# EAGLE design xen_daisy_motherboard (EAGLE 9.6.0)
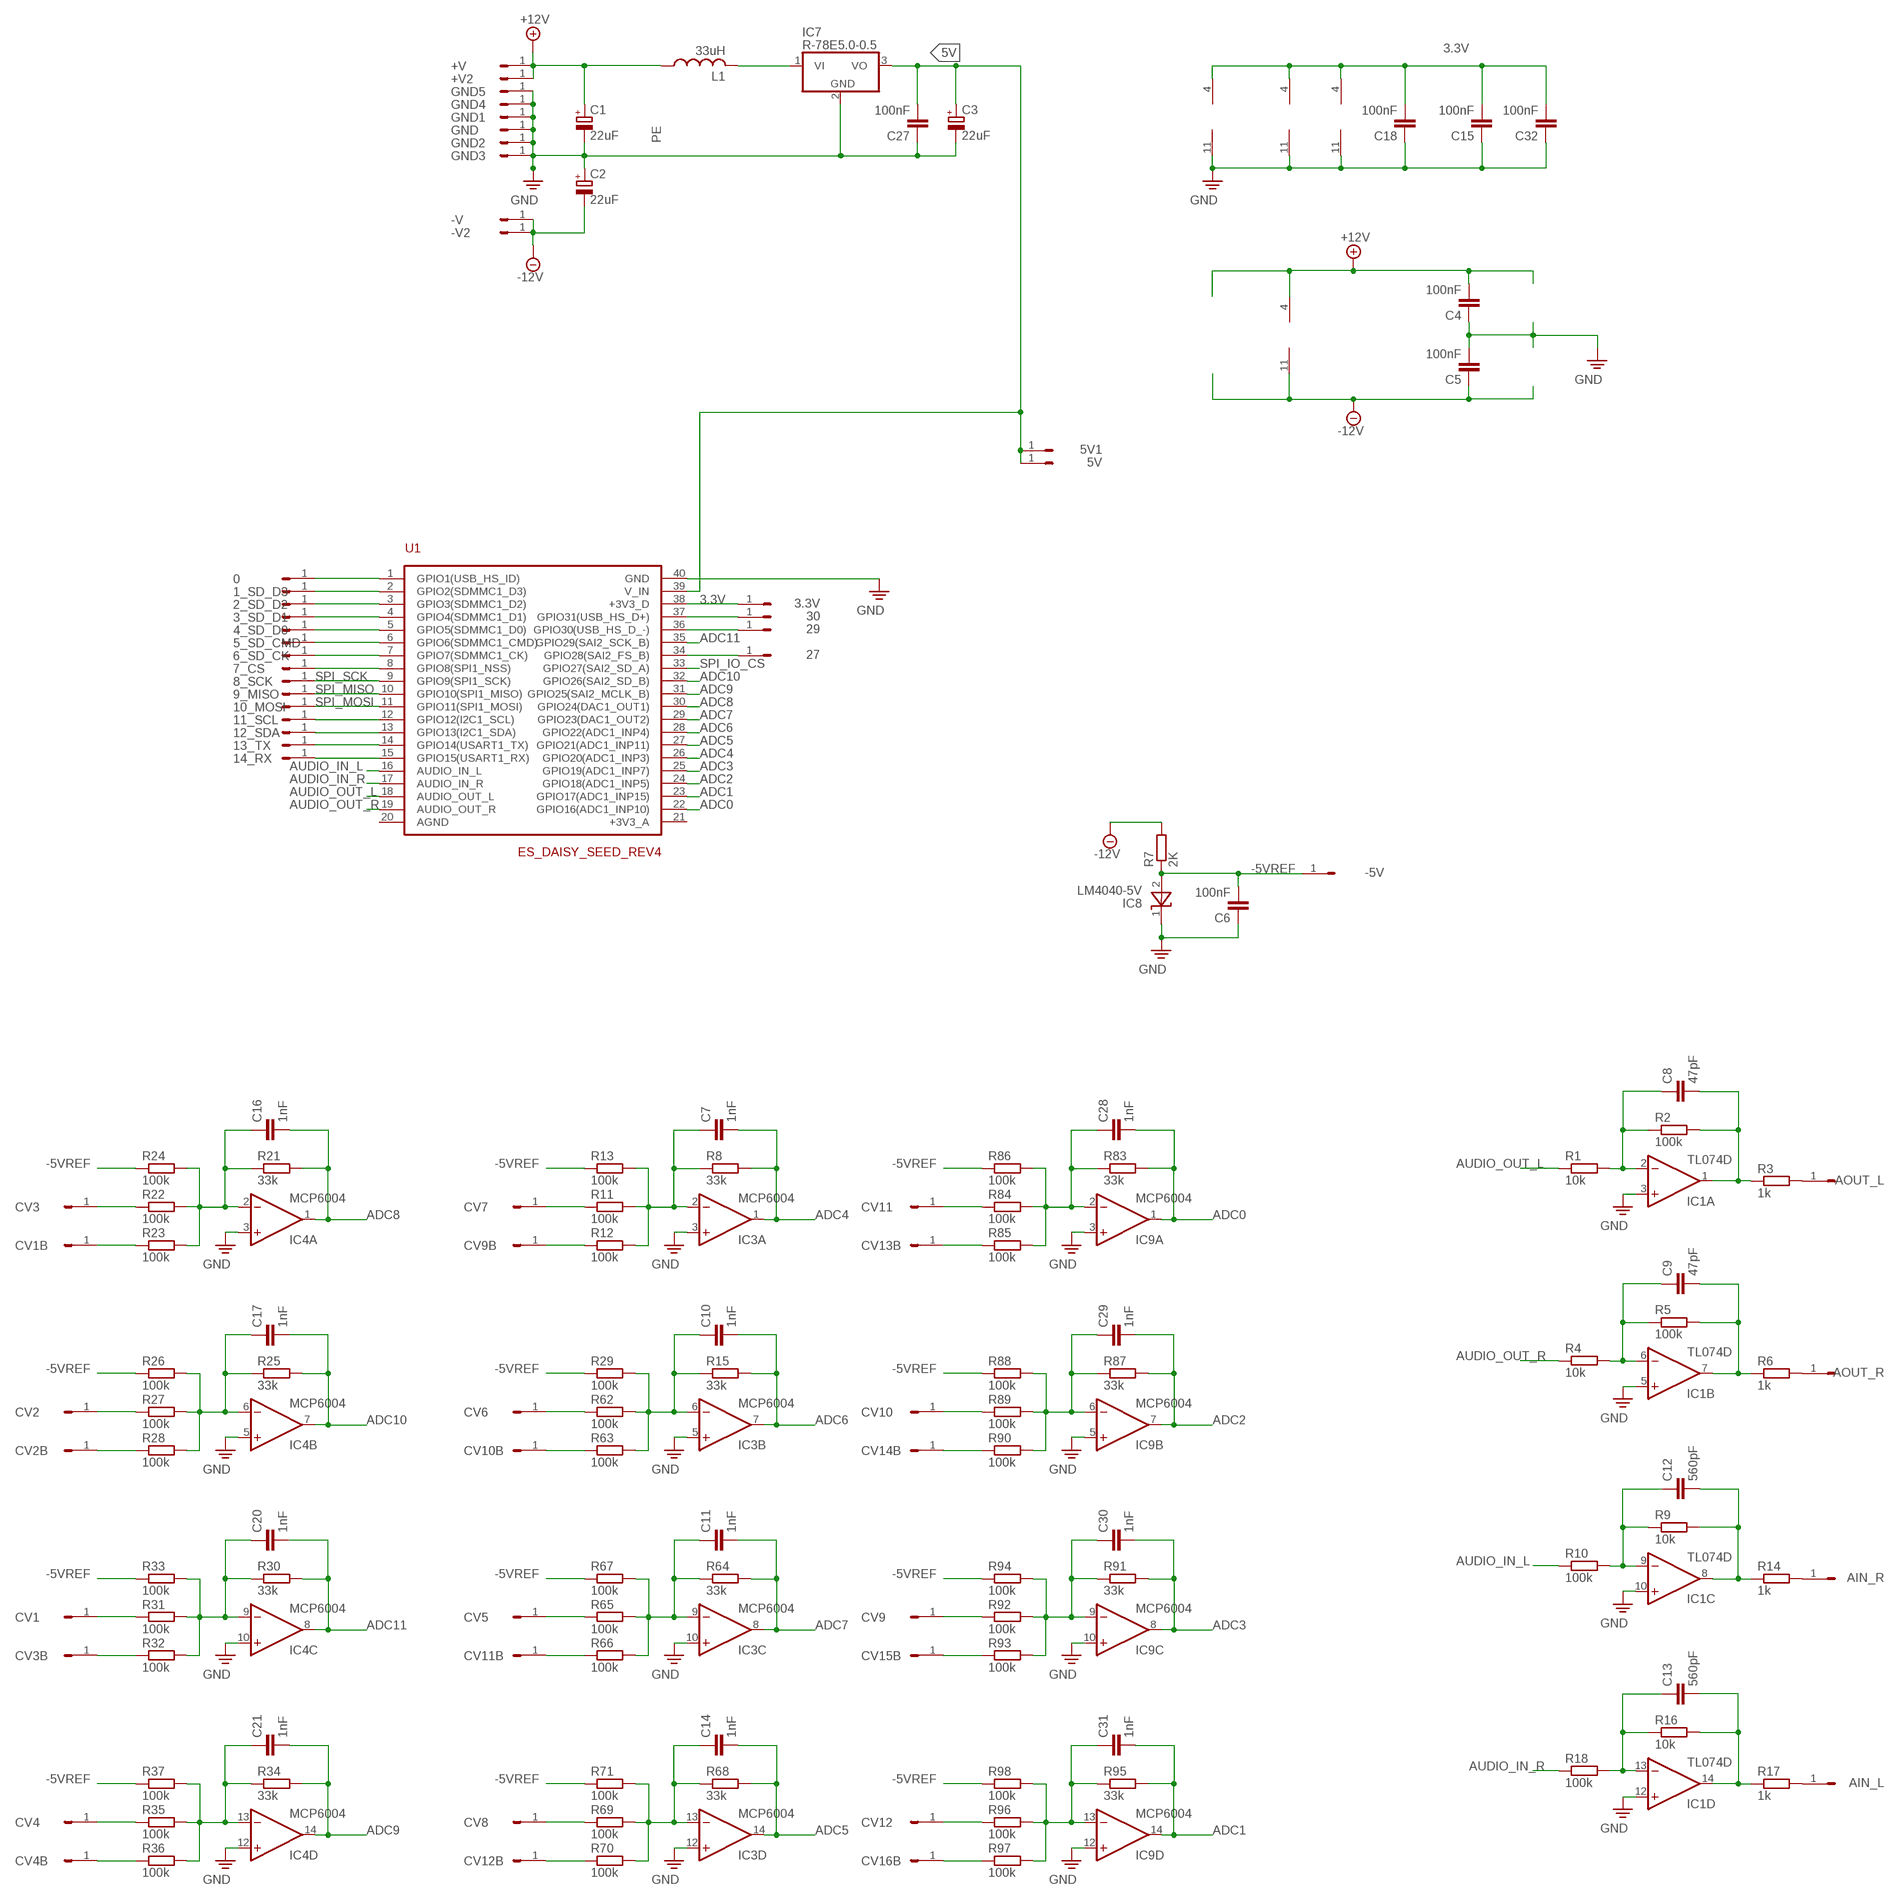
[diagram p0: schematic, sheet 1, part 1 of 2]
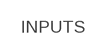
[diagram p1: schematic, sheet 1, part 2 of 2]

## Parts
0  HEADER/MALE/01  [HEADER/MALE/01]
1_SD_D3  HEADER/MALE/01  [HEADER/MALE/01]
2_SD_D2  HEADER/MALE/01  [HEADER/MALE/01]
3.3V  HEADER/MALE/01  [HEADER/MALE/01]
3_SD_D1  HEADER/MALE/01  [HEADER/MALE/01]
4_SD_D0  HEADER/MALE/01  [HEADER/MALE/01]
5_SD_CMD  HEADER/MALE/01  [HEADER/MALE/01]
5V  HEADER/MALE/01  [HEADER/MALE/01]
5V1  HEADER/MALE/01  [HEADER/MALE/01]
6_SD_CK  HEADER/MALE/01  [HEADER/MALE/01]
7_CS  HEADER/MALE/01  [HEADER/MALE/01]
8_SCK  HEADER/MALE/01  [HEADER/MALE/01]
9_MISO  HEADER/MALE/01  [HEADER/MALE/01]
10_MOSI  HEADER/MALE/01  [HEADER/MALE/01]
11_SCL  HEADER/MALE/01  [HEADER/MALE/01]
12_SDA  HEADER/MALE/01  [HEADER/MALE/01]
13_TX  HEADER/MALE/01  [HEADER/MALE/01]
14_RX  HEADER/MALE/01  [HEADER/MALE/01]
27  HEADER/MALE/01  [HEADER/MALE/01]
29  HEADER/MALE/01  [HEADER/MALE/01]
30  HEADER/MALE/01  [HEADER/MALE/01]
+V  HEADER/MALE/01  [HEADER/MALE/01]
+V2  HEADER/MALE/01  [HEADER/MALE/01]
-5V  HEADER/MALE/01  [HEADER/MALE/01]
-V  HEADER/MALE/01  [HEADER/MALE/01]
-V2  HEADER/MALE/01  [HEADER/MALE/01]
AIN_L  HEADER/MALE/01  [HEADER/MALE/01]
AIN_R  HEADER/MALE/01  [HEADER/MALE/01]
AOUT_L  HEADER/MALE/01  [HEADER/MALE/01]
AOUT_R  HEADER/MALE/01  [HEADER/MALE/01]
C1  22uF  CAPACITOR/POLARIZED  [PANASONIC_A]
C2  22uF  CAPACITOR/POLARIZED  [PANASONIC_A]
C3  22uF  CAPACITOR/POLARIZED  [PANASONIC_A]
C4  100nF  CAPACITORC0603  [C0603]
C5  100nF  CAPACITORC0603  [C0603]
C6  100nF  CAPACITORC0603  [C0603]
C7  1nF  CAPACITORC0603  [C0603]
C8  47pF  CAPACITORC0603  [C0603]
C9  47pF  CAPACITORC0603  [C0603]
C10  1nF  CAPACITORC0603  [C0603]
C11  1nF  CAPACITORC0603  [C0603]
C12  560pF  CAPACITORC0603  [C0603]
C13  560pF  CAPACITORC0603  [C0603]
C14  1nF  CAPACITORC0603  [C0603]
C15  100nF  CAPACITORC0603  [C0603]
C16  1nF  CAPACITORC0603  [C0603]
C17  1nF  CAPACITORC0603  [C0603]
C18  100nF  CAPACITORC0603  [C0603]
C20  1nF  CAPACITORC0603  [C0603]
C21  1nF  CAPACITORC0603  [C0603]
C27  100nF  CAPACITORC0603  [C0603]
C28  1nF  CAPACITORC0603  [C0603]
C29  1nF  CAPACITORC0603  [C0603]
C30  1nF  CAPACITORC0603  [C0603]
C31  1nF  CAPACITORC0603  [C0603]
C32  100nF  CAPACITORC0603  [C0603]
CV1  HEADER/MALE/01  [HEADER/MALE/01]
CV1B  HEADER/MALE/01  [HEADER/MALE/01]
CV2  HEADER/MALE/01  [HEADER/MALE/01]
CV2B  HEADER/MALE/01  [HEADER/MALE/01]
CV3  HEADER/MALE/01  [HEADER/MALE/01]
CV3B  HEADER/MALE/01  [HEADER/MALE/01]
CV4  HEADER/MALE/01  [HEADER/MALE/01]
CV4B  HEADER/MALE/01  [HEADER/MALE/01]
CV5  HEADER/MALE/01  [HEADER/MALE/01]
CV6  HEADER/MALE/01  [HEADER/MALE/01]
CV7  HEADER/MALE/01  [HEADER/MALE/01]
CV8  HEADER/MALE/01  [HEADER/MALE/01]
CV9  HEADER/MALE/01  [HEADER/MALE/01]
CV9B  HEADER/MALE/01  [HEADER/MALE/01]
CV10  HEADER/MALE/01  [HEADER/MALE/01]
CV10B  HEADER/MALE/01  [HEADER/MALE/01]
CV11  HEADER/MALE/01  [HEADER/MALE/01]
CV11B  HEADER/MALE/01  [HEADER/MALE/01]
CV12  HEADER/MALE/01  [HEADER/MALE/01]
CV12B  HEADER/MALE/01  [HEADER/MALE/01]
CV13B  HEADER/MALE/01  [HEADER/MALE/01]
CV14B  HEADER/MALE/01  [HEADER/MALE/01]
CV15B  HEADER/MALE/01  [HEADER/MALE/01]
CV16B  HEADER/MALE/01  [HEADER/MALE/01]
GND  HEADER/MALE/01  [HEADER/MALE/01]
GND1  HEADER/MALE/01  [HEADER/MALE/01]
GND2  HEADER/MALE/01  [HEADER/MALE/01]
GND3  HEADER/MALE/01  [HEADER/MALE/01]
GND4  HEADER/MALE/01  [HEADER/MALE/01]
GND5  HEADER/MALE/01  [HEADER/MALE/01]
IC1  TL074D  [SO14]
IC3  MCP6004  TL074D  [SO14]
IC4  MCP6004  TL074D  [SO14]
IC7  R-78E5.0-0.5  WE173950378  [WE78]
IC8  LM4040-5V  LM4040CYM3-2.5  [SOT-23]
IC9  MCP6004  TL074D  [SO14]
L1  33uH  INDUCTORL2012C  [L2012C]
R1  10k  RESISTOR  [R0603]
R2  100k  RESISTOR  [R0603]
R3  1k  RESISTOR  [R0603]
R4  10k  RESISTOR  [R0603]
R5  100k  RESISTOR  [R0603]
R6  1k  RESISTOR  [R0603]
R7  2K  RESISTOR  [R0603]
R8  33k  RESISTOR  [R0603]
R9  10k  RESISTOR  [R0603]
R10  100k  RESISTOR  [R0603]
R11  100k  RESISTOR  [R0603]
R12  100k  RESISTOR  [R0603]
R13  100k  RESISTOR  [R0603]
R14  1k  RESISTOR  [R0603]
R15  33k  RESISTOR  [R0603]
R16  10k  RESISTOR  [R0603]
R17  1k  RESISTOR  [R0603]
R18  100k  RESISTOR  [R0603]
R21  33k  RESISTOR  [R0603]
R22  100k  RESISTOR  [R0603]
R23  100k  RESISTOR  [R0603]
R24  100k  RESISTOR  [R0603]
R25  33k  RESISTOR  [R0603]
R26  100k  RESISTOR  [R0603]
R27  100k  RESISTOR  [R0603]
R28  100k  RESISTOR  [R0603]
R29  100k  RESISTOR  [R0603]
R30  33k  RESISTOR  [R0603]
R31  100k  RESISTOR  [R0603]
R32  100k  RESISTOR  [R0603]
R33  100k  RESISTOR  [R0603]
R34  33k  RESISTOR  [R0603]
R35  100k  RESISTOR  [R0603]
R36  100k  RESISTOR  [R0603]
R37  100k  RESISTOR  [R0603]
R62  100k  RESISTOR  [R0603]
R63  100k  RESISTOR  [R0603]
R64  33k  RESISTOR  [R0603]
R65  100k  RESISTOR  [R0603]
R66  100k  RESISTOR  [R0603]
R67  100k  RESISTOR  [R0603]
R68  33k  RESISTOR  [R0603]
R69  100k  RESISTOR  [R0603]
R70  100k  RESISTOR  [R0603]
R71  100k  RESISTOR  [R0603]
R83  33k  RESISTOR  [R0603]
R84  100k  RESISTOR  [R0603]
R85  100k  RESISTOR  [R0603]
R86  100k  RESISTOR  [R0603]
R87  33k  RESISTOR  [R0603]
R88  100k  RESISTOR  [R0603]
R89  100k  RESISTOR  [R0603]
R90  100k  RESISTOR  [R0603]
R91  33k  RESISTOR  [R0603]
R92  100k  RESISTOR  [R0603]
R93  100k  RESISTOR  [R0603]
R94  100k  RESISTOR  [R0603]
R95  33k  RESISTOR  [R0603]
R96  100k  RESISTOR  [R0603]
R97  100k  RESISTOR  [R0603]
R98  100k  RESISTOR  [R0603]
U1  ES_DAISY_SEED_REV4  [ES_DAISY_SEED]

## Nets
3.3V: 3.3V.1 C15.2 C18.2 C32.2 IC3.4(P:V+) IC4.4(P:V+) IC9.4(P:V+) U1.38(+3V3_D)
5V: 5V1.1 5V.1 C3.+ C27.2 IC7.3(VO) U1.39(V_IN)
+12V: +V2.1 +V.1 C1.+ C4.2 IC1.4(P:V+) L1.1
-5VREF: -5V.1 C6.2 IC8.2(A) R7.1 R13.1 R24.1 R26.1 R29.1 R33.1 R37.1 R67.1 R71.1 R86.1 R88.1 R94.1 R98.1
-12V: -V2.1 -V.1 C2.- C5.1 IC1.11(P:V-) R7.2
ADC0: C28.2 IC9.1(A:OUT) R83.2 U1.22(GPIO16(ADC1_INP10))
ADC1: C31.2 IC9.14(D:OUT) R95.2 U1.23(GPIO17(ADC1_INP15))
ADC2: C29.2 IC9.7(B:OUT) R87.2 U1.24(GPIO18(ADC1_INP5))
ADC3: C30.2 IC9.8(C:OUT) R91.2 U1.25(GPIO19(ADC1_INP7))
ADC4: C7.2 IC3.1(A:OUT) R8.2 U1.26(GPIO20(ADC1_INP3))
ADC5: C14.2 IC3.14(D:OUT) R68.2 U1.27(GPIO21(ADC1_INP11))
ADC6: C10.2 IC3.7(B:OUT) R15.2 U1.28(GPIO22(ADC1_INP4))
ADC7: C11.2 IC3.8(C:OUT) R64.2 U1.29(GPIO23(DAC1_OUT2))
ADC8: C16.2 IC4.1(A:OUT) R21.2 U1.30(GPIO24(DAC1_OUT1))
ADC9: C21.2 IC4.14(D:OUT) R34.2 U1.31(GPIO25(SAI2_MCLK_B))
ADC10: C17.2 IC4.7(B:OUT) R25.2 U1.32(GPIO26(SAI2_SD_B))
ADC11: C20.2 IC4.8(C:OUT) R30.2 U1.35(GPIO29(SAI2_SCK_B))
AUDIO_IN_L: R10.1 U1.16(AUDIO_IN_L)
AUDIO_IN_R: R18.1 U1.17(AUDIO_IN_R)
AUDIO_OUT_L: R1.1 U1.18(AUDIO_OUT_L)
AUDIO_OUT_R: R4.1 U1.19(AUDIO_OUT_R)
N$1: CV2.1 R27.1
N$2: C8.1 IC1.2(A:-IN) R1.2 R2.1
N$3: C8.2 IC1.1(A:OUT) R2.2 R3.1
N$4: C9.1 IC1.6(B:-IN) R4.2 R5.1
N$5: AOUT_L.1 R3.2
N$6: C9.2 IC1.7(B:OUT) R5.2 R6.1
N$7: AIN_R.1 R14.2
N$8: C7.1 IC3.2(A:-IN) R8.1 R11.2 R12.2 R13.2
N$9: AOUT_R.1 R6.2
N$12: C12.1 IC1.9(C:-IN) R9.1 R10.2
N$13: CV9B.1 R12.1
N$14: CV7.1 R11.1
N$15: C13.1 IC1.13(D:-IN) R16.1 R18.2
N$16: C10.1 IC3.6(B:-IN) R15.1 R29.2 R62.2 R63.2
N$17: C13.2 IC1.14(D:OUT) R16.2 R17.1
N$18: CV6.1 R62.1
N$19: CV10B.1 R63.1
N$20: C12.2 IC1.8(C:OUT) R9.2 R14.1
N$22: CV3.1 R22.1
N$24: C16.1 IC4.2(A:-IN) R21.1 R22.2 R23.2 R24.2
N$25: AIN_L.1 R17.2
N$26: CV2B.1 R28.1
N$27: CV1B.1 R23.1
N$29: C17.1 IC4.6(B:-IN) R25.1 R26.2 R27.2 R28.2
N$30: C21.1 IC4.13(D:-IN) R34.1 R35.2 R36.2 R37.2
N$31: CV4.1 R35.1
N$32: CV4B.1 R36.1
N$34: CV3B.1 R32.1
N$35: CV1.1 R31.1
N$36: C20.1 IC4.9(C:-IN) R30.1 R31.2 R32.2 R33.2
N$37: 27.1 U1.34(GPIO28(SAI2_FS_B))
N$38: 13_TX.1 U1.14(GPIO14(USART1_TX))
N$39: 14_RX.1 U1.15(GPIO15(USART1_RX))
N$40: 30.1 U1.37(GPIO31(USB_HS_D+))
N$41: 6_SD_CK.1 U1.7(GPIO7(SDMMC1_CK))
N$45: 12_SDA.1 U1.13(GPIO13(I2C1_SDA))
N$46: 11_SCL.1 U1.12(GPIO12(I2C1_SCL))
N$51: IC7.1(VI) L1.2
N$57: C14.1 IC3.13(D:-IN) R68.1 R69.2 R70.2 R71.2
N$60: CV8.1 R69.1
N$68: CV12B.1 R70.1
N$69: CV11B.1 R66.1
N$70: CV5.1 R65.1
N$71: C11.1 IC3.9(C:-IN) R64.1 R65.2 R66.2 R67.2
N$74: 29.1 U1.36(GPIO30(USB_HS_D_-))
N$75: C28.1 IC9.2(A:-IN) R83.1 R84.2 R85.2 R86.2
N$76: CV13B.1 R85.1
N$77: CV11.1 R84.1
N$78: C29.1 IC9.6(B:-IN) R87.1 R88.2 R89.2 R90.2
N$79: CV10.1 R89.1
N$80: CV14B.1 R90.1
N$81: C31.1 IC9.13(D:-IN) R95.1 R96.2 R97.2 R98.2
N$82: CV12.1 R96.1
N$83: CV16B.1 R97.1
N$84: CV15B.1 R93.1
N$102: CV9.1 R92.1
N$103: C30.1 IC9.9(C:-IN) R91.1 R92.2 R93.2 R94.2
N$108: 7_CS.1 U1.8(GPIO8(SPI1_NSS))
N$109: 5_SD_CMD.1 U1.6(GPIO6(SDMMC1_CMD))
N$110: 4_SD_D0.1 U1.5(GPIO5(SDMMC1_D0))
N$111: 3_SD_D1.1 U1.4(GPIO4(SDMMC1_D1))
N$112: 2_SD_D2.1 U1.3(GPIO3(SDMMC1_D2))
N$113: 1_SD_D3.1 U1.2(GPIO2(SDMMC1_D3))
N$114: 0.1 U1.1(GPIO1(USB_HS_ID))
PE: C1.- C2.+ C3.- C4.1 C5.2 C6.1 C15.1 C18.1 C27.1 C32.1 GND1.1 GND2.1 GND3.1 GND4.1 GND5.1 GND.1 IC1.3(A:+IN) IC1.5(B:+IN) IC1.10(C:+IN) IC1.12(D:+IN) IC3.3(A:+IN) IC3.5(B:+IN) IC3.10(C:+IN) IC3.11(P:V-) IC3.12(D:+IN) IC4.3(A:+IN) IC4.5(B:+IN) IC4.10(C:+IN) IC4.11(P:V-) IC4.12(D:+IN) IC7.2(GND) IC8.1(C) IC9.3(A:+IN) IC9.5(B:+IN) IC9.10(C:+IN) IC9.11(P:V-) IC9.12(D:+IN) U1.40(GND) ; supply symbol labelled GND
SPI_IO_CS: U1.33(GPIO27(SAI2_SD_A))
SPI_MISO: 9_MISO.1 U1.10(GPIO10(SPI1_MISO))
SPI_MOSI: 10_MOSI.1 U1.11(GPIO11(SPI1_MOSI))
SPI_SCK: 8_SCK.1 U1.9(GPIO9(SPI1_SCK))
Unconnected: U1.20(AGND) U1.21(+3V3_A)

## Notes on the sheet
- INPUTS

## Library data of the parts
0 1_SD_D3 2_SD_D2 3.3V 3_SD_D1 4_SD_D0 5_SD_CMD 5V 5V1 6_SD_CK 7_CS 8_SCK 9_MISO 10_MOSI 11_SCL 12_SDA 13_TX 14_RX 27 29 30 +V +V2 -5V -V -V2 AIN_L AIN_R AOUT_L AOUT_R CV1 CV1B CV2 CV2B CV3 CV3B CV4 CV4B CV5-CV9 CV9B CV10 CV10B CV11 CV11B CV12 CV12B CV13B CV14B CV15B CV16B GND GND1-GND5 = connectors:HEADER/MALE/01; SPICEPREFIX: X
C1-C3 = capacitors:CAPACITOR/POLARIZED: POLARIZED CAPACITOR, European symbol; SPICEPREFIX: C
C4-C18 C20 C21 C27-C32 = capacitors:CAPACITOR: CAPACITOR, European symbol
IC1 IC3 IC4 IC9 = ic_analogue:TL074: OP AMP
IC7 = ic_voltage_reg:WE173950378
IC8 = ic_voltage_reg:LM4040
L1 = resistors:INDUCTOR
R1-R18 R21-R37 R62-R71 R83-R98 = resistors:RESISTOR: RESISTOR, European symbol
U1 = microcontroller:ES_DAISY_SEED_REV4; IPN: Daisy Seed

## Board
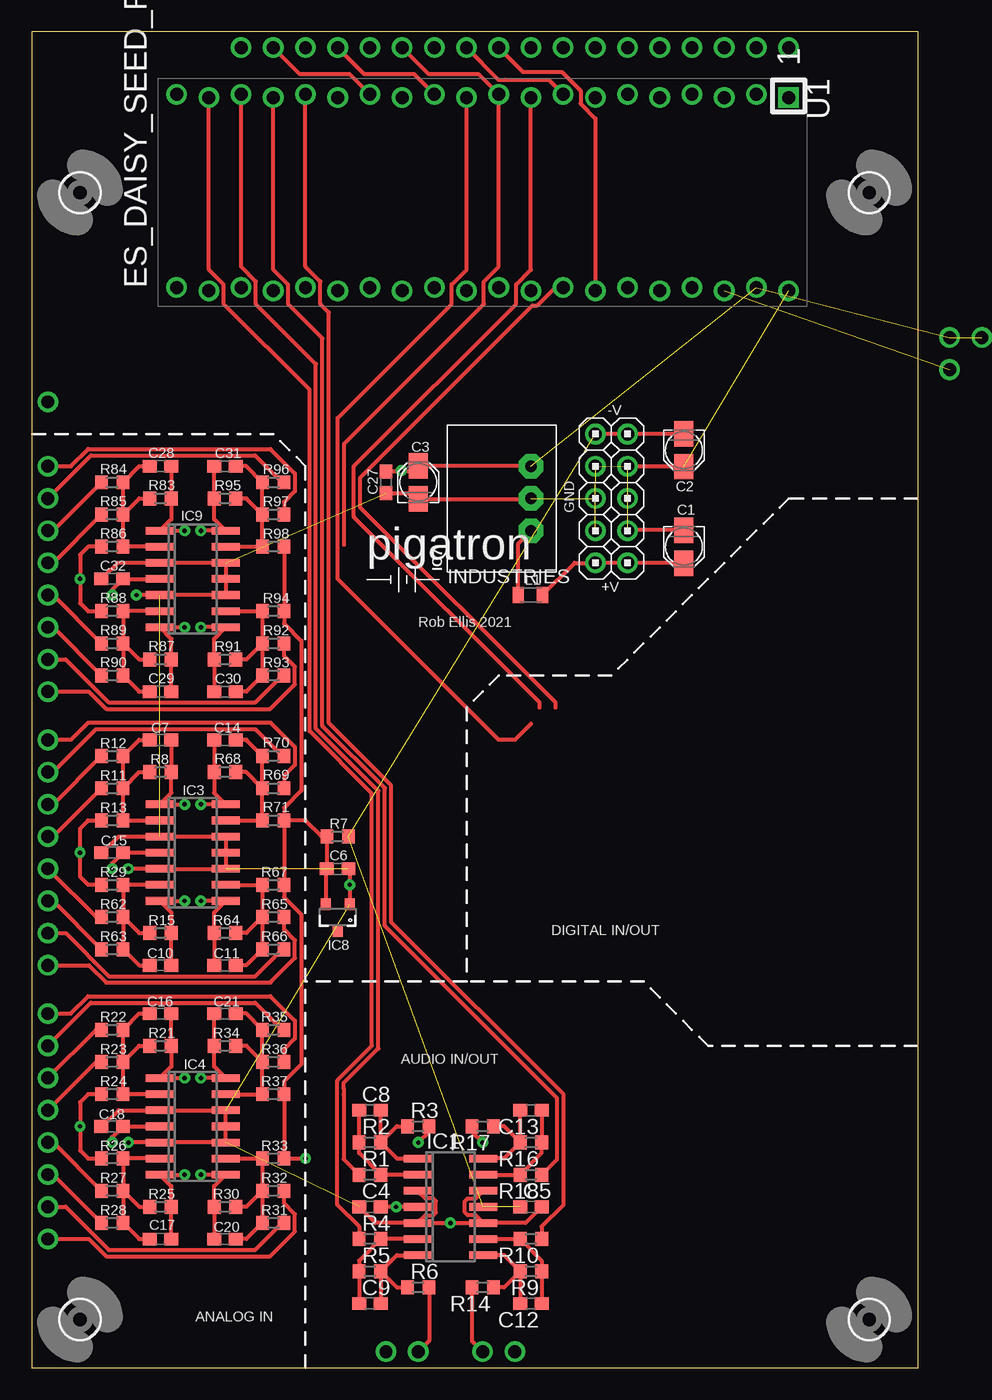
[diagram p2: board, top side]
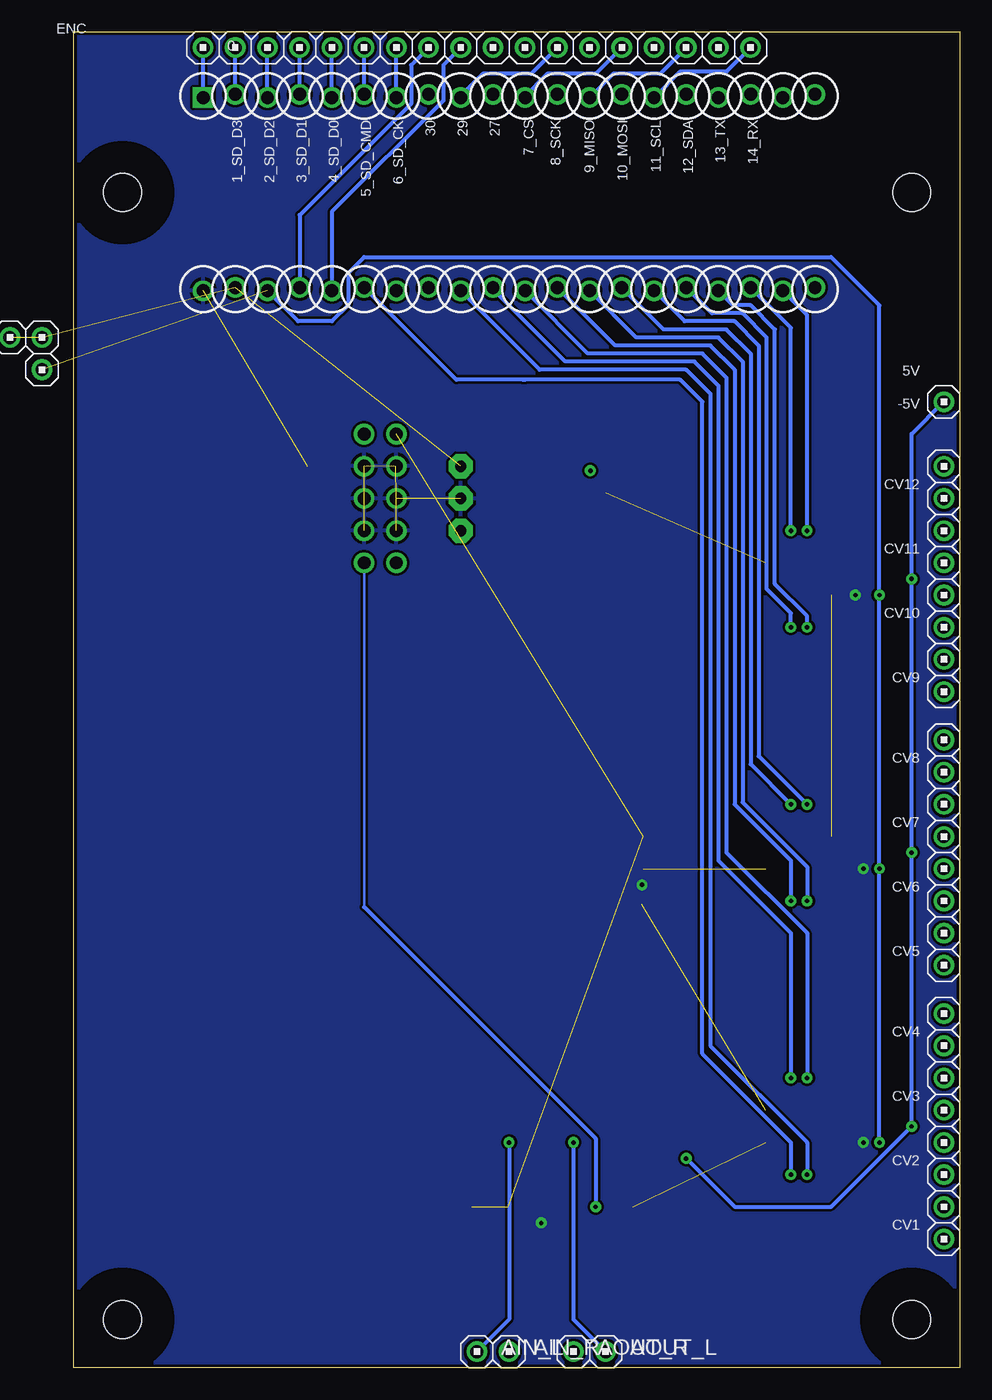
[diagram p3: board, bottom side, seen from below]

Size 69.9 x 105.4 mm. Coordinates in mm from the lower left corner, seen from the top.
Outline: 0,0 69.9,0 69.9,105.4 0,105.4 0,0
Copper layers (1*16): Top 0.0356mm / dielectric 1.5011mm / Bottom 0.0356mm
Design rules "pigatron *": minimum track width 8mil, minimum drill 13mil, track to track 8mil, track to pad 8mil, pad to pad 8mil, via to via 8mil, smd to smd 6mil, copper to edge 10mil, drill to drill 10mil, minimum pad ring 12mil, minimum via ring 10mil, stop-mask expansion 4mil, vias tented up to drill 0mil, thermal gap 10mil

### Footprints (pad centres in the part's own frame; a part is rotated, then mirrored left to right if it is on the bottom)
HEADER/MALE/01 = drill 1.016: 1 0,0
PANASONIC_A = smd 2 x 1.5: + 1.3,0; - -1.3,0
C0603 = smd 1.1 x 1: 1 -0.85,0; 2 0.85,0
SO14 = smd 0.6 x 2.2: 1 -3.81,-2.6; 2 -2.54,-2.6; 3 -1.27,-2.6; 4 0,-2.6; 5 1.27,-2.6; 6 2.54,-2.6; 7 3.81,-2.6; 8 3.81,2.6; 9 2.54,2.6; 10 1.27,2.6; 11 0,2.6; 12 -1.27,2.6; 13 -2.54,2.6; 14 -3.81,2.6
WE78 = drill 0.9 pad 1.93 octagon: 1 -2.54,0; 2 0,0; 3 2.54,0
SOT-23 = smd 0.8 x 0.9: 1 -0.95,-1; 2 0.95,-1; 3 0,1.1
L2012C = smd 0.9 x 1.25: 1 -0.9,0; 2 1,0
R0603 = smd 1 x 1.1: 1 -0.85,0; 2 0.85,0
ES_DAISY_SEED = drill 1.016 square: 1 -7.493,24.13 | drill 1.016: 2 -7.747,21.59; 3 -7.493,19.05; 4 -7.747,16.51; 5 -7.493,13.97; 6 -7.747,11.43; 7 -7.493,8.89; 8 -7.747,6.35; 9 -7.493,3.81; 10 -7.747,1.27; 11 -7.493,-1.27; 12 -7.747,-3.81; 13 -7.493,-6.35; 14 -7.747,-8.89; 15 -7.493,-11.43; 16 -7.747,-13.97; 17 -7.493,-16.51; 18 -7.747,-19.05; 19 -7.493,-21.59; 20 -7.747,-24.13; 21 7.493,-24.13; 22 7.747,-21.59; 23 7.493,-19.05; 24 7.747,-16.51; 25 7.493,-13.97; 26 7.747,-11.43; 27 7.493,-8.89; 28 7.747,-6.35; 29 7.493,-3.81; 30 7.747,-1.27; 31 7.493,1.27; 32 7.747,3.81; 33 7.493,6.35; 34 7.747,8.89; 35 7.493,11.43; 36 7.747,13.97; 37 7.493,16.51; 38 7.747,19.05; 39 7.493,21.59; 40 7.747,24.13
STANDOFF/3.0 = hole 3: 0,0

### Placement (x,y rotation side)
0  59.69,104.14 0 bottom
1_SD_D3  57.15,104.14 270 bottom
2_SD_D2  54.61,104.14 270 bottom
3.3V  72.39,78.74 270 bottom
3_SD_D1  52.07,104.14 270 bottom
4_SD_D0  49.53,104.14 270 bottom
5_SD_CMD  46.99,104.14 270 bottom
5V  74.93,81.28 0 bottom  (outside the outline)
5V1  72.39,81.28 180 bottom
6_SD_CK  44.45,104.14 270 bottom
7_CS  34.29,104.14 270 bottom
8_SCK  31.75,104.14 270 bottom
9_MISO  29.21,104.14 270 bottom
10_MOSI  26.67,104.14 270 bottom
11_SCL  24.13,104.14 270 bottom
12_SDA  21.59,104.14 270 bottom
13_TX  19.05,104.14 270 bottom
14_RX  16.51,104.14 270 bottom
27  36.83,104.14 270 bottom
29  39.37,104.14 270 bottom
30  41.91,104.14 270 bottom
+V  46.99,63.5 0 top
+V2  44.45,63.5 180 top
-5V  1.27,76.2 180 bottom
-V  46.99,73.66 0 top
-V2  44.45,73.66 180 top
AIN_L  38.1,1.27 0 bottom
AIN_R  35.56,1.27 0 bottom
AOUT_L  27.94,1.27 0 bottom
AOUT_R  30.48,1.27 0 bottom
C1  51.44,64.77 270 top
C2  51.44,72.39 270 top
C3  30.48,69.85 90 top
C4  26.67,12.7 0 top
C5  39.37,12.7 0 top
C6  24.13,39.37 180 top
C7  10.16,49.53 0 top
C8  26.67,20.32 0 top
C9  26.67,5.08 0 top
C10  10.16,31.75 0 top
C11  15.24,31.75 180 top
C12  39.37,5.08 180 top
C13  39.37,20.32 180 top
C14  15.24,49.53 180 top
C15  6.35,40.64 0 top
C16  10.16,27.94 0 top
C17  10.16,10.16 0 top
C18  6.35,19.05 0 top
C20  15.24,10.16 180 top
C21  15.24,27.94 180 top
C27  27.94,69.85 90 top
C28  10.16,71.12 0 top
C29  10.16,53.34 0 top
C30  15.24,53.34 180 top
C31  15.24,71.12 180 top
C32  6.35,62.23 0 top
CV1  1.27,12.7 0 bottom
CV1B  1.27,20.32 0 bottom
CV2  1.27,17.78 0 bottom
CV2B  1.27,15.24 0 bottom
CV3  1.27,22.86 0 bottom
CV3B  1.27,10.16 0 bottom
CV4  1.27,25.4 0 bottom
CV4B  1.27,27.94 0 bottom
CV5  1.27,31.75 180 bottom
CV6  1.27,39.37 180 bottom
CV7  1.27,41.91 180 bottom
CV8  1.27,49.53 180 bottom
CV9  1.27,53.34 180 bottom
CV9B  1.27,44.45 180 bottom
CV10  1.27,60.96 180 bottom
CV10B  1.27,36.83 180 bottom
CV11  1.27,66.04 180 bottom
CV11B  1.27,34.29 180 bottom
CV12  1.27,68.58 180 bottom
CV12B  1.27,46.99 180 bottom
CV13B  1.27,63.5 180 bottom
CV14B  1.27,58.42 180 bottom
CV15B  1.27,55.88 180 bottom
CV16B  1.27,71.12 180 bottom
GND  46.99,68.58 0 top
GND1  46.99,71.12 0 top
GND2  44.45,66.04 180 top
GND3  46.99,66.04 180 top
GND4  44.45,68.58 0 top
GND5  44.45,71.12 0 top
IC1  33.02,12.7 270 top
IC3  12.7,40.64 270 top
IC4  12.7,19.05 270 top
IC7  39.37,68.58 90 top
IC8  24.13,35.56 180 top
IC9  12.7,62.23 270 top
L1  39.37,60.96 180 top
R1  26.67,15.24 0 top
R2  26.67,17.78 0 top
R3  30.48,19.05 0 top
R4  26.67,10.16 0 top
R5  26.67,7.62 0 top
R6  30.48,6.35 0 top
R7  24.13,41.91 0 top
R8  10.16,46.99 0 top
R9  39.37,7.62 180 top
R10  39.37,10.16 180 top
R11  6.35,45.72 0 top
R12  6.35,48.26 0 top
R13  6.35,43.18 0 top
R14  35.56,6.35 180 top
R15  10.16,34.29 0 top
R16  39.37,17.78 180 top
R17  35.56,19.05 180 top
R18  39.37,15.24 180 top
R21  10.16,25.4 0 top
R22  6.35,26.67 0 top
R23  6.35,24.13 0 top
R24  6.35,21.59 0 top
R25  10.16,12.7 0 top
R26  6.35,16.51 0 top
R27  6.35,13.97 0 top
R28  6.35,11.43 0 top
R29  6.35,38.1 0 top
R30  15.24,12.7 180 top
R31  19.05,11.43 180 top
R32  19.05,13.97 180 top
R33  19.05,16.51 180 top
R34  15.24,25.4 180 top
R35  19.05,26.67 180 top
R36  19.05,24.13 180 top
R37  19.05,21.59 180 top
R62  6.35,35.56 0 top
R63  6.35,33.02 0 top
R64  15.24,34.29 180 top
R65  19.05,35.56 180 top
R66  19.05,33.02 180 top
R67  19.05,38.1 180 top
R68  15.24,46.99 180 top
R69  19.05,45.72 180 top
R70  19.05,48.26 180 top
R71  19.05,43.18 180 top
R83  10.16,68.58 0 top
R84  6.35,69.85 0 top
R85  6.35,67.31 0 top
R86  6.35,64.77 0 top
R87  10.16,55.88 0 top
R88  6.35,59.69 0 top
R89  6.35,57.15 0 top
R90  6.35,54.61 0 top
R91  15.24,55.88 180 top
R92  19.05,57.15 180 top
R93  19.05,54.61 180 top
R94  19.05,59.69 180 top
R95  15.24,68.58 180 top
R96  19.05,69.85 180 top
R97  19.05,67.31 180 top
R98  19.05,64.77 180 top
U1  35.56,92.71 270 top
U$1  [PIGATRON-LOGO]  35.31,63.75 0 top
U$2  [STANDOFF/3.0]  66.04,3.81 180 top
U$3  [STANDOFF/3.0]  3.81,3.81 180 top
U$4  [STANDOFF/3.0]  66.04,92.71 180 top
U$5  [STANDOFF/3.0]  3.81,92.71 180 top

### Tracks (layer width: path | path; a pad name or v marks a point on that pad's centre or on a via)
3.3V  (via drill 0.35)  (1 unrouted)
  Top 0.305: IC4.4 C18.2 6.35,18.2 v6.35,17.78 | IC3.4 C15.2 6.35,39.79 v6.35,39.37 | IC9.4 C32.2 6.35,61.38 v6.35,60.96
  Bottom 0.305: v6.35,17.78 v6.35,39.37 v6.35,60.96 6.35,83.82 10.16,87.63 46.99,87.63 48.26,86.36 48.26,83.82 49.53,82.55 52.2,82.55 U1.38
5V  (via drill 0.35)  (3 unrouted)
  Top 0.305: IC7.3 30.51,71.12 C3.+ 30.03,70.7 29.21,70.7 | 29.21,70.7 C27.2 | 29.21,70.7 v29.14,70.77
+12V  (via drill 0.35)
  Top 0.305: C4.2 v28.73,12.7 IC1.4 | L1.1 42.81,63.5 +V2.1 +V.1 47.02,63.47 C1.+
  Bottom 0.203: 46.99,36.35 +V.1
  Bottom 0.305: v28.73,12.7 28.73,18.1 46.99,36.35
-5VREF  (via drill 0.35)
  Top 0.305: IC8.2 23.18,39.27 C6.2 R7.1 22.86,41.91 21.59,43.18 R71.1 | R71.1 R67.1 19.9,37.11 21.26,35.75 21.26,23.94 19.9,22.58 R37.1 R33.1 v21.59,16.51 | R98.1 R94.1 19.9,58.7 21.26,57.34 21.26,45.53 19.9,44.17 R71.1 | R29.1 4.45,38.1 3.81,38.73 v3.81,40.64 3.81,42.55 4.45,43.18 R13.1 | R24.1 4.45,21.59 3.81,20.95 v3.81,19.05 3.81,17.14 4.45,16.51 R26.1 | R86.1 4.45,64.77 3.81,64.14 v3.81,62.23 3.81,60.33 4.45,59.69 R88.1
  Bottom 0.305: v21.59,16.51 17.78,12.7 10.16,12.7 v3.81,19.05 v3.81,40.64 v3.81,62.23 3.81,73.66 -5V.1
-12V  (3 unrouted)
  Top 0.305: 44.48,73.69 -V2.1 -V.1 47.02,73.69 C2.-
ADC0  (via drill 0.35)
  Top 0.305: C28.2 R83.2 11.01,66.95 IC9.1 v12.06,66.04
  Bottom 0.305: v12.06,66.04 12.06,83.06 U1.22
ADC1  (via drill 0.35)
  Top 0.305: C31.2 R95.2 14.39,66.95 IC9.14 v13.34,66.04
  Bottom 0.305: U1.23 13.34,82.04 v13.34,66.04
ADC2  (via drill 0.35)
  Top 0.305: C29.2 R87.2 11.01,57.51 IC9.7 v12.06,58.42
  Bottom 0.305: v12.06,58.42 12.06,59.3 14.61,61.84 14.61,81.92 16.51,83.82 17.91,83.82 U1.24
ADC3  (via drill 0.35)
  Top 0.305: C30.2 R91.2 14.39,57.51 IC9.8 v13.34,58.42
  Bottom 0.305: v13.34,58.42 13.34,59.53 15.24,61.44 15.24,81.28 17.14,83.19 19.56,83.19 U1.25
ADC4  (via drill 0.35)
  Top 0.305: C7.2 R8.2 11.01,45.36 IC3.1 v12.06,44.45
  Bottom 0.305: v12.06,44.45 15.88,48.26 15.88,80.64 17.78,82.55 21.72,82.55 U1.26
ADC5  (via drill 0.35)
  Top 0.305: C14.2 R68.2 14.39,45.36 IC3.14 v13.34,44.45
  Bottom 0.305: v13.34,44.45 16.51,47.62 16.51,80.01 18.41,81.92 23.37,81.92 U1.27
ADC6  (via drill 0.35)
  Top 0.305: C10.2 R15.2 11.01,35.92 IC3.7 v12.06,36.83
  Bottom 0.305: v12.06,36.83 12.06,39.53 17.14,44.61 17.14,79.38 19.05,81.28 25.53,81.28 U1.28
ADC7  (via drill 0.35)
  Top 0.305: C11.2 R64.2 14.39,35.92 IC3.8 v13.34,36.83
  Bottom 0.305: v13.34,36.83 13.34,40.01 17.78,44.45 17.78,78.74 19.68,80.64 27.18,80.64 U1.29
ADC8  (via drill 0.35)
  Top 0.305: C16.2 R21.2 11.01,23.77 IC4.1 v12.06,22.86
  Bottom 0.305: v12.06,22.86 12.06,34.29 18.41,40.64 18.41,78.11 20.32,80.01 29.34,80.01 U1.30
ADC9  (via drill 0.35)
  Top 0.305: C21.2 R34.2 14.39,23.77 IC4.14 v13.34,22.86
  Bottom 0.305: v13.34,22.86 13.34,34.29 19.05,40.01 19.05,77.47 20.95,79.38 31.11,79.38 36.83,85.09 U1.31
ADC10  (via drill 0.35)
  Top 0.305: C17.2 R25.2 11.01,14.33 IC4.7 v12.06,15.24
  Bottom 0.305: v12.06,15.24 12.06,17.78 19.68,25.4 19.68,76.83 21.59,78.74 33.15,78.74 U1.32
ADC11  (via drill 0.35)
  Top 0.305: C20.2 R30.2 14.39,14.33 IC4.8 v13.34,15.24
  Bottom 0.305: v13.34,15.24 13.34,17.78 20.32,24.77 20.32,76.2 22.07,77.95 34.29,77.95 34.45,77.95 39.72,77.95 U1.35
AUDIO_IN_L
  Top 0.305: R10.1 40.22,11.15 41.94,12.87 41.94,21.56 28.35,35.15 28.35,45.94 23.43,50.86 23.43,83.25 22.76,83.92 22.76,85.7 21.59,86.87 U1.16
AUDIO_IN_R
  Top 0.305: R18.1 41.43,16.45 41.43,21.27 32.62,30.08 27.84,34.86 27.84,45.73 22.92,50.65 22.92,81.22 20.22,83.92 20.22,85.45 19.05,86.61 U1.17
AUDIO_OUT_L
  Top 0.305: R1.1 24.61,16.45 24.61,21.59 24.61,22.07 24.61,22.46 27.34,25.19 27.34,45.52 22.42,50.44 22.42,79.18 17.68,83.92 17.68,85.7 16.51,86.87 U1.18
AUDIO_OUT_R
  Top 0.305: R4.1 25.82,11.15 24.1,12.87 24.1,22.67 26.83,25.4 26.83,45.31 21.91,50.23 21.91,77.15 15.14,83.92 15.14,85.45 13.97,86.61 U1.19
N$1
  Top 0.305: R27.1 1.69,17.78 CV2.1
N$2
  Top 0.305: IC1.2 R1.2 25.82,16.94 R2.1 C8.1
N$3
  Top 0.305: R2.2 28.79,16.51 IC1.1 | R2.2 28.79,19.05 R3.1 | R2.2 C8.2
N$4
  Top 0.305: IC1.6 R4.2 25.82,8.46 R5.1 C9.1
N$5  (via drill 0.35)
  Top 0.305: R3.2 31.33,18.63 v30.48,17.78
  Bottom 0.305: v30.48,17.78 30.48,3.81 AOUT_L.1
N$6
  Top 0.305: R5.2 28.79,8.89 IC1.7 | R5.2 28.79,6.35 R6.1 | R5.2 C9.2
N$7
  Top 0.305: R14.2 34.71,2.12 AIN_R.1
N$8
  Top 0.305: IC3.2 R13.2 R11.2 | R11.2 8.47,46.99 R8.1 | R11.2 R12.2 8.47,49.53 C7.1
N$9
  Top 0.305: R6.2 31.33,2.12 AOUT_R.1
N$12
  Top 0.305: IC1.9 R10.2 40.22,8.46 R9.1 C12.1
N$13
  Top 0.305: R12.1 1.69,44.45 CV9B.1
N$14
  Top 0.305: R11.1 1.69,41.91 CV7.1
N$15
  Top 0.305: IC1.13 R18.2 40.22,16.94 R16.1 C13.1
N$16
  Top 0.305: IC3.6 R29.2 R62.2 | R62.2 R63.2 8.47,31.75 C10.1 | R62.2 8.47,34.29 R15.1
N$17
  Top 0.305: R16.2 37.25,16.51 IC1.14 | R16.2 37.25,19.05 R17.1 | R16.2 C13.2
N$18
  Top 0.305: CV6.1 5.08,35.56 R62.1
N$19
  Top 0.305: R63.1 1.69,36.83 CV10B.1
N$20
  Top 0.305: R9.2 37.25,8.89 IC1.8 | R9.2 37.25,6.35 R14.1 | R9.2 C12.2
N$22
  Top 0.305: R22.1 5.08,26.67 CV3.1
N$24
  Top 0.305: IC4.2 R24.2 R23.2 | R23.2 R22.2 8.47,27.94 C16.1 | R23.2 8.47,25.4 R21.1
N$25  (via drill 0.35)
  Top 0.305: R17.2 34.71,18.63 v35.56,17.78
  Bottom 0.305: v35.56,17.78 35.56,3.81 AIN_L.1
N$26
  Top 0.305: R28.1 1.69,15.24 CV2B.1
N$27
  Top 0.305: R23.1 5.08,24.13 CV1B.1
N$29
  Top 0.305: IC4.6 R26.2 R27.2 | R27.2 R28.2 8.47,10.16 C17.1 | R27.2 8.47,12.7 R25.1
N$30
  Top 0.305: IC4.13 R37.2 R36.2 | R36.2 R35.2 16.93,27.94 C21.1 | R36.2 16.93,25.4 R34.1
N$31
  Top 0.305: R35.1 19.75,26.67 17.63,28.8 4.67,28.8 CV4.1
N$32
  Top 0.305: R36.1 19.9,25.12 20.76,25.97 20.76,27.37 18.82,29.3 4.46,29.3 3.09,27.94 CV4B.1
N$34
  Top 0.305: R32.1 19.9,12.98 20.76,12.13 20.76,10.73 18.82,8.8 5.86,8.8 4.5,10.16 CV3B.1
N$35
  Top 0.305: R31.1 19.75,11.43 17.63,9.3 6.07,9.3 2.68,12.7 CV1.1
N$36
  Top 0.305: IC4.9 R33.2 R32.2 | R32.2 R31.2 16.93,10.16 C20.1 | R32.2 16.93,12.7 R30.1
N$37
  Top 0.305: 27.1 38.73,102.23 41.78,102.23 43.28,100.74 43.28,99.72 44.45,98.55 U1.34
N$38
  Top 0.305: 13_TX.1 21.11,102.08 25.05,102.08 U1.14
N$39
  Bottom 0.305: 14_RX.1 18.41,102.23 22.1,102.23 U1.15
N$40
  Bottom 0.305: 30.1 43.28,102.77 43.28,99.72 52.07,90.93 U1.37
N$41
  Bottom 0.305: U1.7 6_SD_CK.1
N$45
  Bottom 0.305: 12_SDA.1 23.65,102.08 27.34,102.08 U1.13
N$46
  Top 0.305: 11_SCL.1 26.19,102.08 30.13,102.08 U1.12
N$51
  Top 0.305: L1.2 38.37,65.04 IC7.1
N$57
  Top 0.305: IC3.13 R71.2 R69.2 | R69.2 R70.2 16.93,49.53 C14.1 | R69.2 16.93,46.99 R68.1
N$60
  Top 0.305: R69.1 19.9,46.71 20.76,47.56 20.76,48.96 18.82,50.89 4.46,50.89 3.09,49.53 CV8.1
N$68
  Top 0.305: R70.1 19.75,48.26 17.63,50.39 5.08,50.39 1.68,46.99 CV12B.1
N$69
  Top 0.305: R66.1 19.75,33.02 17.63,30.89 6.07,30.89 2.68,34.29 CV11B.1
N$70
  Top 0.305: R65.1 19.9,34.57 20.76,33.72 20.76,32.32 18.82,30.39 5.86,30.39 4.5,31.75 CV5.1
N$71
  Top 0.305: IC3.9 R67.2 R65.2 | R65.2 R66.2 16.93,31.75 C11.1 | R65.2 16.93,34.29 R64.1
N$74
  Bottom 0.305: 29.1 40.74,102.77 40.74,99.97 49.53,91.19 U1.36
N$75
  Top 0.305: IC9.2 R86.2 R85.2 | R85.2 8.47,68.58 R83.1 | R85.2 R84.2 8.47,71.12 C28.1
N$76
  Top 0.305: R85.1 1.69,63.5 CV13B.1
N$77
  Top 0.305: R84.1 1.69,66.04 CV11.1
N$78
  Top 0.305: IC9.6 R88.2 R89.2 | R89.2 R90.2 8.47,53.34 C29.1 | R89.2 8.47,55.88 R87.1
N$79
  Top 0.305: R89.1 1.69,60.96 CV10.1
N$80
  Top 0.305: R90.1 1.69,58.42 CV14B.1
N$81
  Top 0.305: IC9.13 R98.2 R97.2 | R97.2 R96.2 16.93,71.12 C31.1 | R97.2 16.93,68.58 R95.1
N$82
  Top 0.305: R96.1 19.75,69.85 17.63,71.98 4.67,71.98 CV12.1
N$83
  Top 0.305: CV16B.1 3.09,71.12 4.46,72.48 18.82,72.48 20.76,70.55 20.76,69.15 19.9,68.3 R97.1
N$84
  Top 0.305: CV15B.1 2.68,55.88 6.07,52.48 17.63,52.48 19.75,54.61 R93.1
N$102
  Top 0.305: CV9.1 4.5,53.34 5.86,51.98 18.82,51.98 20.76,53.91 20.76,55.31 19.9,56.16 R92.1
N$103
  Top 0.305: IC9.9 R94.2 R92.2 | R92.2 R93.2 16.93,53.34 C30.1 | R92.2 16.93,55.88 R91.1
N$108
  Top 0.305: 7_CS.1 36.8,101.62 37.31,101.62 37.34,101.6 40.77,101.6 U1.8
N$109
  Bottom 0.305: U1.6 5_SD_CMD.1
N$110
  Bottom 0.305: U1.5 4_SD_D0.1
N$111
  Bottom 0.305: U1.4 3_SD_D1.1
N$112
  Bottom 0.305: U1.3 2_SD_D2.1
N$113
  Bottom 0.305: U1.2 1_SD_D3.1
N$114
  Bottom 0.305: U1.1 0.1
PE  (via drill 0.35)  (12 unrouted)
  Top 0.305: C18.1 5.58,19.05 6.84,20.32 IC4.3 IC4.12 IC4.11 IC4.10 IC4.5 v7.62,17.78 | C15.1 5.58,40.64 6.84,41.91 IC3.3 IC3.12 IC3.11 15.3,39.43 15.24,39.37 | IC3.10 15.24,39.37 | v7.62,39.37 IC3.5 15.24,39.37 | IC8.1 v25.08,38.1 25.08,39.27 C6.1 | v8.26,60.96 IC9.5 IC9.10 IC9.11 IC9.12 IC9.3 6.77,63.5 C32.1 | GND5.1 44.48,71.09 | C27.1 30.03,69 C3.- 39.34,68.55 IC7.2 | IC1.10 35.01,12.04 34.37,12.04 34.16,12.25 34.16,13.15 34.37,13.36 35.01,13.36 IC1.12 | IC1.5 31.03,12.04 31.67,12.04 31.88,12.25 31.88,13.15 31.67,13.36 31.03,13.36 IC1.3 | C5.2 38.95,11.43 IC1.10 | C4.1 27.09,11.43 IC1.5 | IC1.5 v33.02,11.43 IC1.10 | C2.+ 47.02,71.09 GND1.1 | C1.- 47.02,66.07 GND3.1
  pour Bottom: 0,105.41 69.85,105.41 69.85,0 0,0
  pour Bottom: 0,105.41 69.85,105.41 69.85,0 0,0
SPI_IO_CS
  Top 0.305: 41.32,52.06 41.32,52.47 25.91,67.88 25.91,70.22 39.48,83.8 39.85,83.8 41.28,85.22 U1.33
SPI_MISO
  Top 0.305: 9_MISO.1 31.27,102.08 35.21,102.08 U1.10 36.83,86.87 35.66,85.7 35.66,83.92 24.64,72.9 24.64,64.93
SPI_MOSI
  Top 0.305: 39.37,50.8 38.1,49.53 36.83,49.53 24.13,62.23 24.13,74.93 33.12,83.92 33.12,85.45 34.29,86.61 U1.11
  Bottom 0.305: U1.11 34.42,100.2 32.54,102.08 28.73,102.08 10_MOSI.1
SPI_SCK
  Top 0.305: 40.05,52.06 40.05,52.47 25.4,67.12 25.4,71.12 38.2,83.92 38.2,85.45 39.37,86.61 U1.9
  Bottom 0.305: 8_SCK.1 33.81,102.08 37.62,102.08 39.37,100.33 U1.9

### Text on the board
tNames: Rob Ellis 2021 | DIGITAL IN/OUT | AUDIO IN/OUT | ANALOG IN
bNames: ENC | 5V